# EasyEDA Pro project ProProject_PressureSensor_2023-10-08.epro, schematic Schematic1
Create Date: 2023-06-24; Page Name: P1; Project Name: PressureSensor; Schematic Name: Schematic1; Update Date: 2023-07-30; Company: 嘉立创EDA; Page Size: A4; Version: V1.0
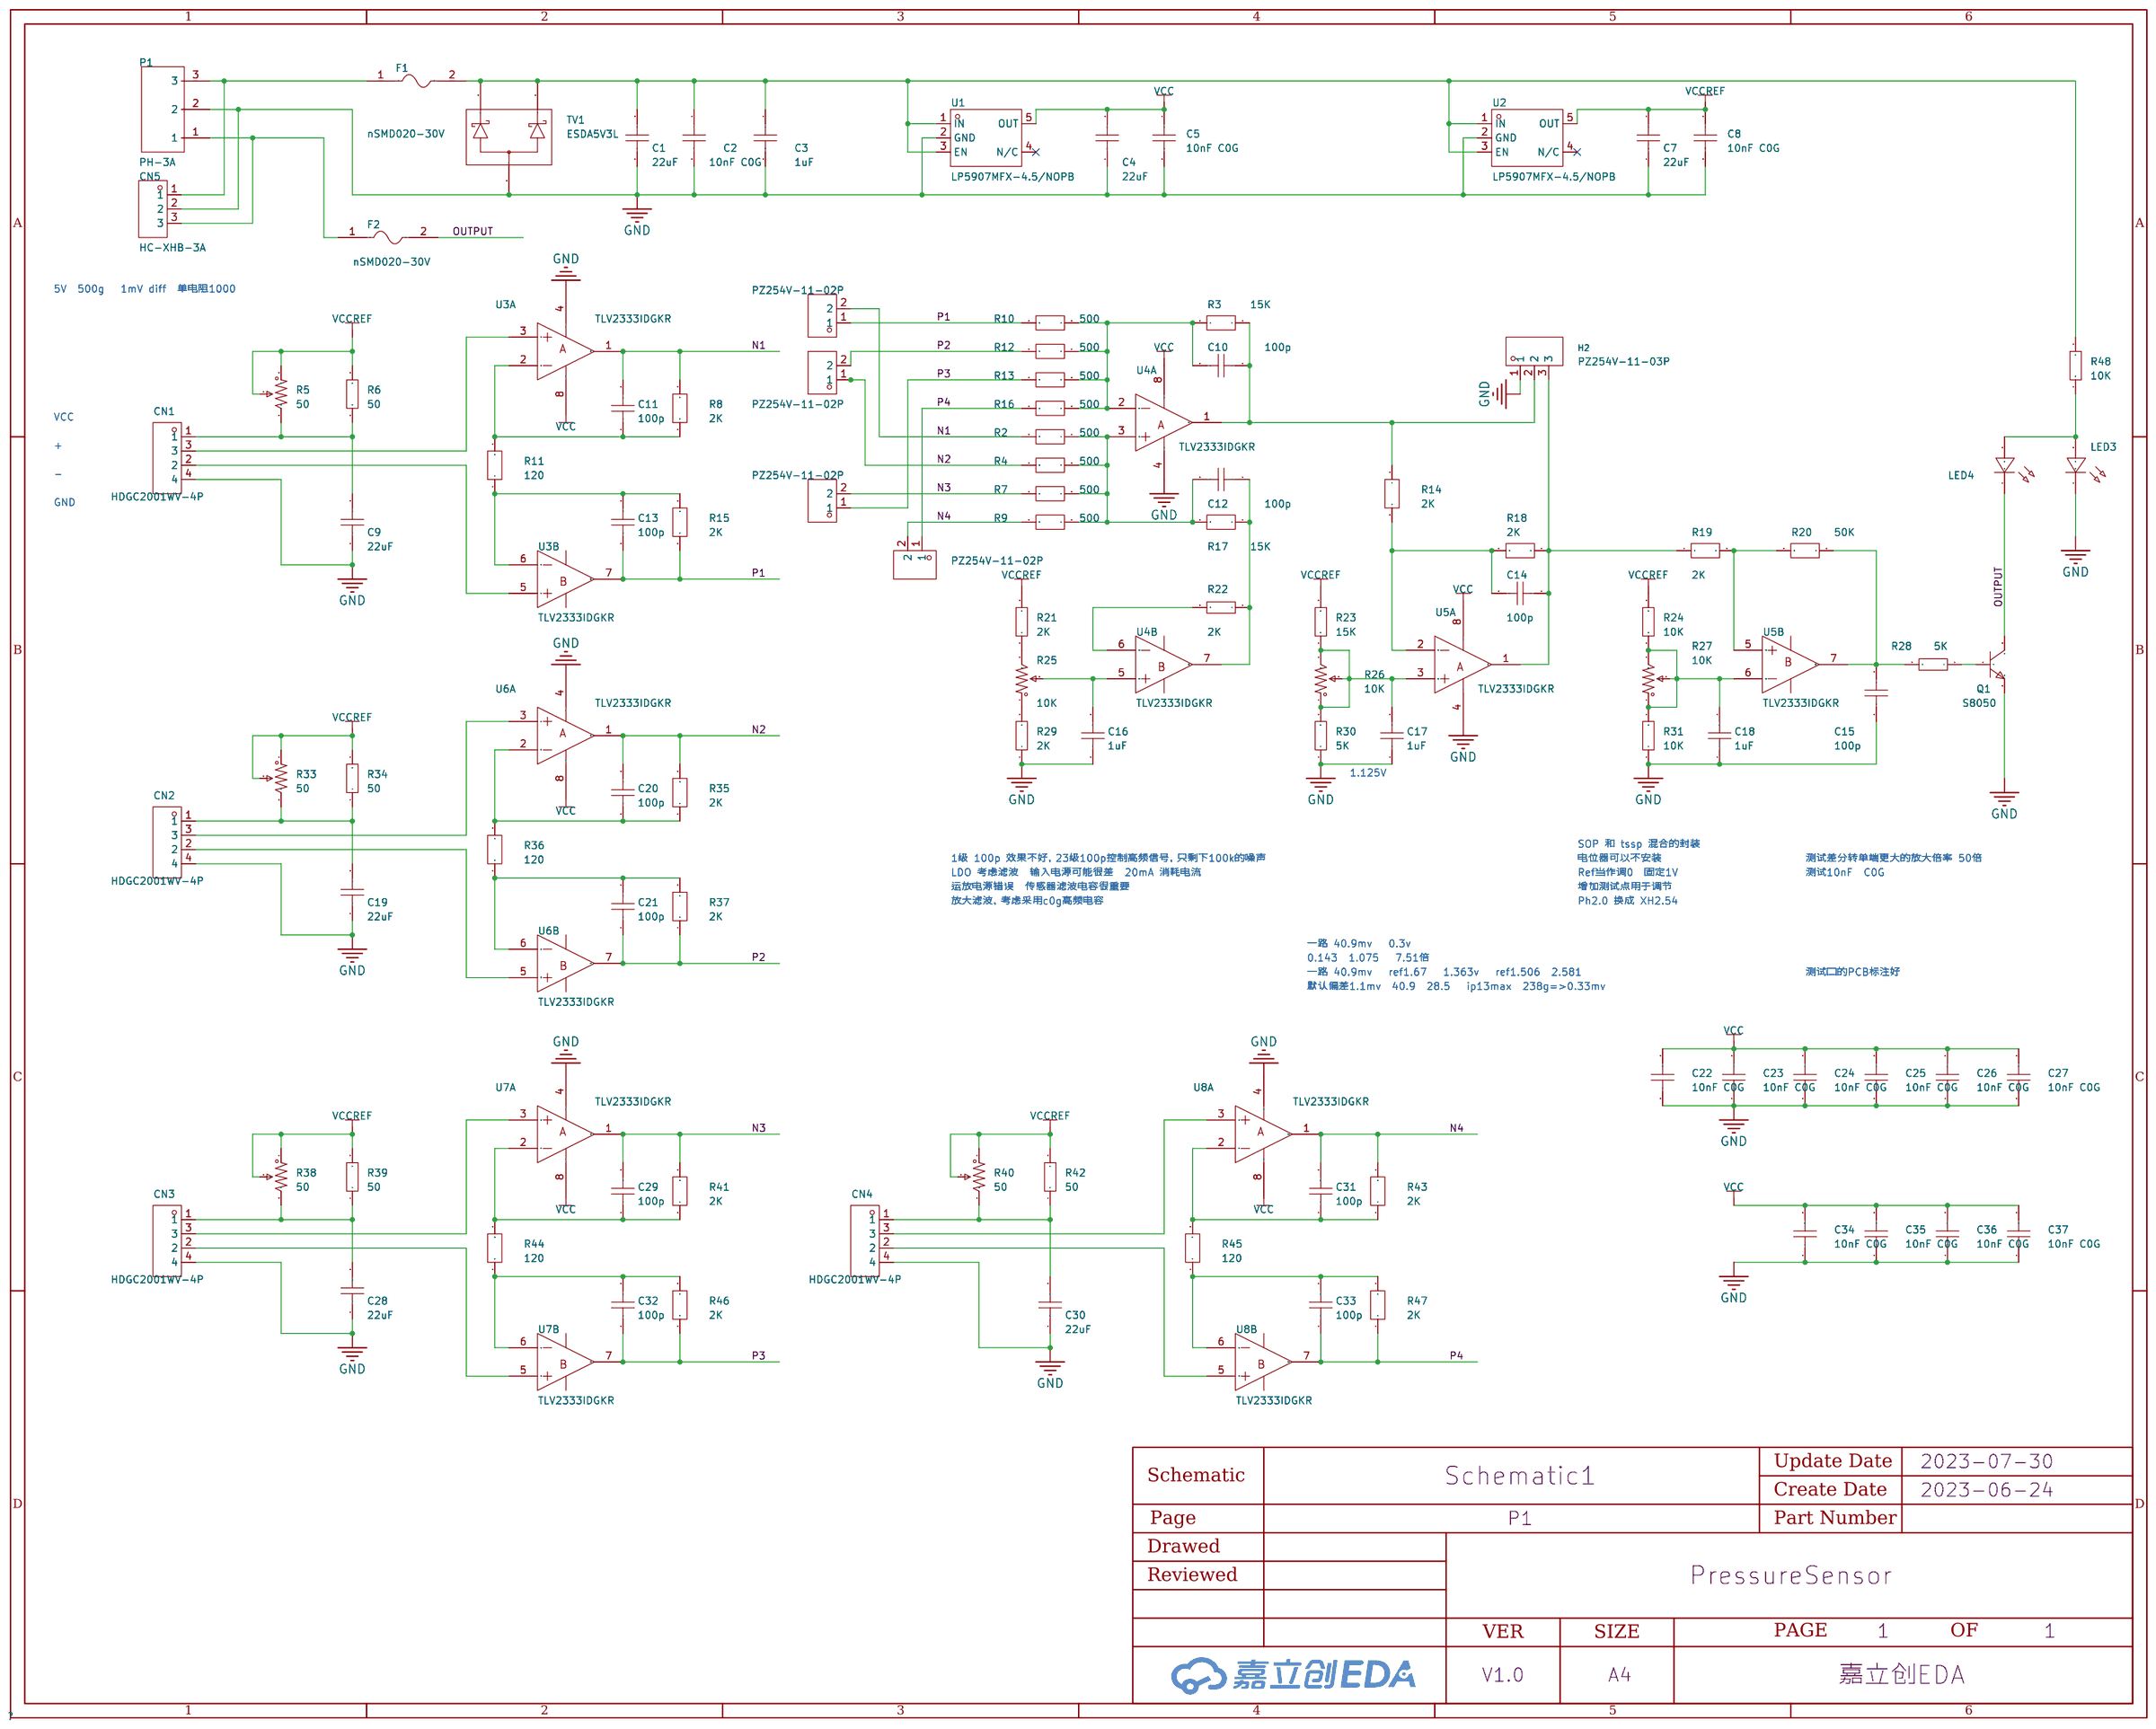
[diagram p0: schematic sheet]

## Parts
C1  22uF  [R0603]
C2  10nF C0G  [R0603]
C3  1uF  [R0603]
C4  22uF  [R0603]
C5  10nF C0G  [R0603]
C7  22uF  [R0603]
C8  10nF C0G  [R0603]
C9  22uF  [R0603]
C10  100p  [R0603]
C11  100p  [R0603]
C12  100p  [R0603]
C13  100p  [R0603]
C14  100p  [R0603]
C15  100p  [R0603]
C16  1uF  [R0603]
C17  1uF  [R0603]
C18  1uF  [R0603]
C19  22uF  [R0603]
C20  100p  [R0603]
C21  100p  [R0603]
C22  10nF C0G  [R0603]
C23  10nF C0G  [R0603]
C24  10nF C0G  [R0603]
C25  10nF C0G  [R0603]
C26  10nF C0G  [R0603]
C27  10nF C0G  [R0603]
C28  22uF  [R0603]
C29  100p  [R0603]
C30  22uF  [R0603]
C31  100p  [R0603]
C32  100p  [R0603]
C33  100p  [R0603]
C34  10nF C0G  [R0603]
C35  10nF C0G  [R0603]
C36  10nF C0G  [R0603]
C37  10nF C0G  [R0603]
CN1  HDGC2001WV-4P  [CONN-TH_4P-P2.00_HDGC_HDGC2001WV-4P]
CN2  HDGC2001WV-4P  [CONN-TH_4P-P2.00_HDGC_HDGC2001WV-4P]
CN3  HDGC2001WV-4P  [CONN-TH_4P-P2.00_HDGC_HDGC2001WV-4P]
CN4  HDGC2001WV-4P  [CONN-TH_4P-P2.00_HDGC_HDGC2001WV-4P]
CN5  HC-XHB-3A  [CONN-TH_3P-P2.50_HC-XHB-3A]
F1  nSMD020-30V  [F1206]
F2  nSMD020-30V  [F1206]
H2  PZ254V-11-03P  [HDR-TH_3P-P2.54-V-M]
H5  PZ254V-11-02P  [HDR-TH_2P-P2.54-V-M]
H6  PZ254V-11-02P  [HDR-TH_2P-P2.54-V-M]
H7  PZ254V-11-02P  [HDR-TH_2P-P2.54-V-M]
H8  PZ254V-11-02P  [HDR-TH_2P-P2.54-V-M]
LED3  -  [LED_0603]
LED4  -  [LED_0603]
P1  PH-3A  [CONN-TH_12P-P2.00-H-W4.8_PH-3A]
Q1  S8050  [SOT-23-3_L2.9-W1.6-P1.90-LS2.8-BR]
R2  500  [R0603]
R3  15K  [R0603]
R4  500  [R0603]
R5  50  [RES-ADJ-TH_3P-L10.0-W10.0-P2.50-L]
R6  50  [R0603]
R7  500  [R0603]
R8  2K  [R0603]
R9  500  [R0603]
R10  500  [R0603]
R11  120  [R0603]
R12  500  [R0603]
R13  500  [R0603]
R14  2K  [R0603]
R15  2K  [R0603]
R16  500  [R0603]
R17  15K  [R0603]
R18  2K  [R0603]
R19  2K  [R0603]
R20  50K  [R0603]
R21  2K  [R0603]
R22  2K  [R0603]
R23  15K  [R0603]
R24  10K  [R0603]
R25  10K  [RES-ADJ-TH_3P-L10.0-W10.0-P2.50-L]
R26  10K  [RES-ADJ-TH_3P-L10.0-W10.0-P2.50-L]
R27  10K  [RES-ADJ-TH_3P-L10.0-W10.0-P2.50-L]
R28  5K  [R0603]
R29  2K  [R0603]
R30  5K  [R0603]
R31  10K  [R0603]
R33  50  [RES-ADJ-TH_3P-L10.0-W10.0-P2.50-L]
R34  50  [R0603]
R35  2K  [R0603]
R36  120  [R0603]
R37  2K  [R0603]
R38  50  [RES-ADJ-TH_3P-L10.0-W10.0-P2.50-L]
R39  50  [R0603]
R40  50  [RES-ADJ-TH_3P-L10.0-W10.0-P2.50-L]
R41  2K  [R0603]
R42  50  [R0603]
R43  2K  [R0603]
R44  120  [R0603]
R45  120  [R0603]
R46  2K  [R0603]
R47  2K  [R0603]
R48  10K  [R0603]
TV1  ESDA5V3L  [SOT-23-3_L2.9-W1.6-P1.90-LS2.8-BR]
U1  LP5907MFX-4.5/NOPB  [TSOT-23-5_L2.9-W1.6-P0.95-LS2.8-BR]
U2  LP5907MFX-4.5/NOPB  [TSOT-23-5_L2.9-W1.6-P0.95-LS2.8-BR]
U3  TLV2333IDGKR  [VSSOP-8_L3.0-W3.0-P0.65-LS5.0-BL]  (sections 1,2)
U4  TLV2333IDGKR  [SOIC-8_L4.9-W3.9-P1.27-LS6.0-BL]  (sections 1,2)
U5  TLV2333IDGKR  [SOIC-8_L4.9-W3.9-P1.27-LS6.0-BL]  (sections 1,2)
U6  TLV2333IDGKR  [VSSOP-8_L3.0-W3.0-P0.65-LS5.0-BL]  (sections 1,2)
U7  TLV2333IDGKR  [VSSOP-8_L3.0-W3.0-P0.65-LS5.0-BL]  (sections 1,2)
U8  TLV2333IDGKR  [VSSOP-8_L3.0-W3.0-P0.65-LS5.0-BL]  (sections 1,2)

## Library data of the parts
C1-C5 C7-C37 = CAP_0603: Supplier Footprint: 0603
CN1-CN4 = HDGC2001WV-4P: LCSC Part Name: PH2.0直针 4P; Supplier Part: C5175232; Manufacturer: HDGC(华德共创); Supplier Footprint: 直插,P=2mm; JLCPCB Part Class: Extended Part; Datasheet: https://atta.szlcsc.com/upload/public/pdf/source/20220916/C6875813FFA1039A4B3E585D63AEFA0D.pdf; Supplier: LCSC
CN5 = HC-XHB-3A_C2845491: 参考系列:-;间距:2.5mm;插针结构:1x3P;排数:1;每排PIN数:3;行距:-;公母:公型插针;安装方式:直插;额定电流:3A;工作温度范围:-25℃~+85℃;; LCSC Part Name: 2.54带锁扣立式插件 3P 针座连接器线对板/线对线连接器; Supplier Part: C2845491; Manufacturer: HCTL(华灿天禄); Supplier Footprint: 插件,P=2.5mm; JLCPCB Part Class: Extended Part; Datasheet: https://atta.szlcsc.com/upload/public/pdf/source/20210728/C2845490_C6E0123D5C5ECC46C6D4C91ADB43F484.pdf; Supplier: LCSC; Pitch: 2.5mm; Pins Structure: 1x3P; Number of Rows: 1; Number of PINs Per Row: 3; Gender: 公型插针; Mounting Style: 直插; Current Rating (Max): 3A; Operating Temperature Range: -25℃~+85℃
F1 F2 = nSMD020-30V: 最大电压:30V;最大电流:100A;保持电流:200mA;跳闸电流:460mA;; LCSC Part Name: 30V 200mA 1206自恢复; Supplier Part: C69680; Manufacturer: 台湾陆海; Supplier Footprint: 1206; JLCPCB Part Class: Extended Part; Datasheet: https://atta.szlcsc.com/upload/public/pdf/source/20230404/9F5B471D89C649BCC2835D46521A6324.pdf; Supplier: LCSC; Operating Voltage (Max): 30V; Current Rating (Max): 100A; Hold Current: 200mA; Trip Current: 460mA
H2 = PZ254V-11-03P: 排数:单排;总PIN位数:3;间距:2.54mm;插针结构:1x3P;行距:-;安装类型:直插;圆针/方针:方针;额定电流:3A;额定电压:250V;配合针长度:6mm;塑高:2.5mm;端接针长度:3mm;工作温度范围:-40℃~+105℃;颜色:黑色;; LCSC Part Name: 2.54mm 1x3P 直插 方针; Supplier Part: C2937625; Manufacturer: XFCN(兴飞); Supplier Footprint: 直插,P=2.54mm; JLCPCB Part Class: Extended Part; Datasheet: 2022-07-12/581362A/62b9d00620994b3696be7eb4af85ad72/双排排针和单排排针.pdf; Supplier: LCSC; Number of Rows: 单排; Number of Pins: 3; Pitch: 2.54mm; Pin Structure: 1x3P; Mounting Type: 直插; Circluar Pins/Square Pins: 方针; Current Rating (Max): 3A; Voltage Rating (Max): 250V; Length of Mating Pin: 6mm; Insulation Height: 2.5mm; Length of End Connection Pin: 3mm; Operating Temperature Range: -40℃~+105℃; Color: 黑色
H5-H8 = PZ254V-11-02P: 排数:单排;总PIN位数:2P;间距:2.54mm;插针结构:1x2P;行距:-;安装类型:直插;圆针/方针:方针;额定电流:-;额定电压:-;配合针长度:6mm;塑高:2.5mm;端接针长度:3mm;触头材质:黄铜;触头镀层:-;工作温度范围:-40℃~+105℃;颜色:黑色;; LCSC Part Name: 2.54mm 1x2P 直插 方针; Supplier Part: C492401; Manufacturer: XFCN(兴飞); Supplier Footprint: 插件,P=2.54mm; JLCPCB Part Class: Extended Part; Datasheet: https://atta.szlcsc.com/upload/public/pdf/source/20200309/C492401_A812433581A9B211A7FFA413ADDFF0E5.pdf; Supplier: LCSC; Number of Rows: 单排; Number of Pins: 2P; Pitch: 2.54mm; Pin Structure: 1x2P; Mounting Type: 直插; Circluar Pins/Square Pins: 方针; Length of Mating Pin: 6mm; Insulation Height: 2.5mm; Length of End Connection Pin: 3mm; Contact Material: 黄铜; Operating Temperature Range: -40℃~+105℃; Color: 黑色
LED3 LED4 = LED_0603-B: Supplier Footprint: 0603
P1 = PH-3A_C2320: 参考系列:PH;间距:2mm;插针结构:1x3P;排数:1;每排PIN数:3;行距:-;安装方式:-;触头材质:-;; LCSC Part Name: PH 2mm 1x3P 直插; Supplier Part: C2320; Manufacturer: BOOMELE(博穆精密); Supplier Footprint: 插件,P=2mm; JLCPCB Part Class: Extended Part; Datasheet: https://atta.szlcsc.com/upload/public/pdf/source/20151118/1457707579328.pdf; Supplier: LCSC; Reference Series: PH; Pitch: 2mm; Pins Structure: 1x3P; Number of Rows: 1; Number of PINs Per Row: 3
Q1 = S8050_C105433: 晶体管类型:NPN;集射极击穿电压(Vceo):25V;集电极电流(Ic):500mA;功率(Pd):300mW;直流电流增益(hFE@Ic,Vce):120@50mA,1V;; LCSC Part Name: NPN 25V 500mA L档 120-200; Supplier Part: C105433; Manufacturer: CJ(江苏长电/长晶); Supplier Footprint: SOT-23; JLCPCB Part Class: Extended Part; Datasheet: https://atta.szlcsc.com/upload/public/pdf/source/20170415/1492237762328.pdf; Supplier: LCSC; Transistor Type: NPN; Collector-Emitter Breakdown Voltage (Vceo): 25V; Collector Current (Ic): 500mA; Power Dissipation (Pd): 300mW; Collector Cut-Off Current (Icbo): 100nA; Collector-Emitter Saturation Voltage (VCE(sat)@Ic,Ib): 600mV@500mA,50mA; DC Current Gain (hFE@Ic,Vce): 120@50mA,1V; Transition Frequency (fT): 150MHz; Operating Temperature: +150℃@(Tj)
R2-R4 R7-R20 R35-R37 R41 R43-R47 = ARG02BTC4R70: 阻值:4.7Ω;精度:±0.1%;温度系数:±25ppm/℃;; LCSC Part Name: 4.7Ω ±0.1%; Supplier Part: C2984422; Manufacturer: Viking(光颉); Supplier Footprint: 0402; JLCPCB Part Class: Extended Part; Datasheet: https://atta.szlcsc.com/upload/public/pdf/source/20200117/C485675_99063924B4564AF910B7BE66DA8EFA49.pdf; Supplier: LCSC; Tolerance: ±0.1%; Temperature Coefficient: ±25ppm/℃
R5 R25-R27 R33 R38 R40 = 3296W-1-103: 阻值:10kΩ;精度:±10%;; LCSC Part Name: 10kΩ ±10%; Supplier Part: C118954; Manufacturer: BOCHEN(博晨); Supplier Footprint: 插件; JLCPCB Part Class: Extended Part; Datasheet: https://atta.szlcsc.com/upload/public/pdf/source/20171114/C118954_15106326646611117443.pdf; Supplier: LCSC; Tolerance: ±10%
R6 R21-R24 R28-R31 R34 R39 R42 R48 = Res_0603: Supplier Footprint: 0603
TV1 = ESDA5V3L_C87911: Supplier Part: C87911; Manufacturer: ST(意法半导体); Supplier Footprint: SOT-23; JLCPCB Part Class: Extended Part; Datasheet: https://atta.szlcsc.com/upload/public/pdf/source/20161123/1479873117957.pdf; Supplier: LCSC
U1 U2 = LP5907MFX-4.5/NOPB: 输出类型:-;; Supplier Part: C529554; Manufacturer: TI(德州仪器); Supplier Footprint: SOT-23-5; JLCPCB Part Class: Extended Part; Datasheet: https://atta.szlcsc.com/upload/public/pdf/source/20200515/C529554_1F6A3CAA36CA0E645A19879A5E39A7AD.pdf; Supplier: LCSC
U3-U8 = TLV2333IDGKR: 放大器组数:-;; Supplier Part: C527573; Manufacturer: TI(德州仪器); Supplier Footprint: VSSOP-8; JLCPCB Part Class: Extended Part; Datasheet: https://atta.szlcsc.com/upload/public/pdf/source/20200508/C527573_3F1EAB2C8CE40A63573F2737A046710C.pdf; Supplier: LCSC

## Nets
GND: C1.1 C2.2 C3.2 C4.1 C5.2 C7.1 C8.2 C9.1 C15.2 C16.1 C17.1 C18.1 C19.1 C22.1 C23.1 C24.1 C25.1 C26.1 C27.1 C28.1 C30.1 C34.1 C35.1 C36.1 C37.1 CN1.4 CN2.4 CN3.4 CN4.4 CN5.2 H2.1 LED3.1(C) P1.2 Q1.2 R29.1 R30.1 R31.1 TV1.3 U1.2(GND) U2.2(GND) U3.4(V-) U4.4(V-) U5.4(V-) U6.4(V-) U7.4(V-) U8.4(V-)
VCC: C4.2 C5.1 C22.2 C23.2 C24.2 C25.2 C26.2 C27.2 C34.2 C35.2 C36.2 C37.2 U1.5(OUT) U3.8(V+) U4.8(V+) U5.8(V+) U6.8(V+) U7.8(V+) U8.8(V+)
VCCREF: C7.2 C8.1 R5.1 R5.2 R6.2 R21.2 R23.2 R24.2 R33.1 R33.2 R34.2 R38.1 R38.2 R39.2 R40.1 R40.2 R42.2 U2.5(OUT)
N1: C11.2 H5.2 R2.2 R8.2 U3.1(OUTA)
N2: C20.2 H8.1 R4.2 R35.2 U6.1(OUTA)
N3: C29.2 H6.2 R7.2 R41.2 U7.1(OUTA)
N4: C31.2 H7.2 R9.2 R43.2 U8.1(OUTA)
OUTPUT: F2.2 LED4.1(C) Q1.3
P1: C13.1 H5.1 R10.2 R15.1 U3.7(OUTB)
P2: C21.1 H8.2 R12.2 R37.1 U6.7(OUTB)
P3: C32.1 H6.1 R13.2 R46.1 U7.7(OUTB)
P4: C33.1 H7.1 R16.2 R47.1 U8.7(OUTB)
$1N30553: CN1.3 U3.3(INA+)
$1N30561: CN1.2 U3.5(INB+)
$1N30605: C11.1 R8.1 R11.2 U3.2(INA-)
$1N30608: C13.2 R11.1 R15.2 U3.6(INB-)
$1N32010: R21.1 R25.3
$1N32012: R25.1 R29.2
$1N32045: C16.2 R25.2 U4.5(INB+)
$1N32103: R22.2 U4.6(INB-)
$1N32162: C10.2 R3.2 R10.1 R12.1 R13.1 R16.1 U4.2(INA-)
$1N32193: C12.1 R17.1 R22.1 U4.7(OUTB)
$1N32196: C12.2 R2.1 R4.1 R7.1 R9.1 R17.2 U4.3(INA+)
$1N33007: R19.2 R20.2 U5.5(INB+)
$1N33240: Q1.1 R28.1
$1N33276: C15.1 R20.1 R28.2 U5.7(OUTB)
$1N35532: C10.1 H2.2 R3.1 R14.1 U4.1(OUTA)
$1N36334: C14.1 H2.3 R18.1 R19.1 U5.1(OUTA)
$1N36352: C14.2 R14.2 R18.2 U5.2(INA-)
$1N36780: CN2.3 U6.3(INA+)
$1N36784: CN2.2 U6.5(INB+)
$1N36792: C20.1 R35.1 R36.2 U6.2(INA-)
$1N36797: C21.2 R36.1 R37.2 U6.6(INB-)
$1N37205: CN3.3 U7.3(INA+)
$1N37209: CN3.2 U7.5(INB+)
$1N37217: C29.1 R41.1 R44.2 U7.2(INA-)
$1N37222: C32.2 R44.1 R46.2 U7.6(INB-)
$1N37630: CN4.3 U8.3(INA+)
$1N37634: CN4.2 U8.5(INB+)
$1N37642: C31.1 R43.1 R45.2 U8.2(INA-)
$1N37647: C33.2 R45.1 R47.2 U8.6(INB-)
$1N37723: C19.2 CN2.1 R33.3 R34.1
$1N37747: C28.2 CN3.1 R38.3 R39.1
$1N37752: C9.2 CN1.1 R5.3 R6.1
$1N37762: C30.2 CN4.1 R40.3 R42.1
$1N42503: CN5.1 F1.1 P1.3
$1N42542: CN5.3 F2.1 P1.1
$1N42787: LED3.2(A) LED4.2(A) R48.1
$1N42798: C1.2 C2.1 C3.1 F1.2 R48.2 TV1.1 TV1.2 U1.1(IN) U1.3(EN) U2.1(IN) U2.3(EN)
$1N53934: C17.2 R23.1 R26.1 R26.2 R26.3 R30.2 U5.3(INA+)
Net-(C18-2): C18.2 R24.1 R27.1 R27.2 R27.3 R31.2 U5.6(INB-)

Not connected (* = marked no-connect by the designer): U1 4(N/C)*; U2 4(N/C)*

## Notes on the sheet
- 5V  500g   1mV diff  单电阻1000
- VCC
- +
- -
- GND
- 1.125V
- SOP 和 tssp 混合的封装
- 1级 100p 效果不好，23级100p控制高频信号，只剩下100k的噪声
- 电位器可以不安装
- 测试差分转单端更大的放大倍率 50倍
- LDO 考虑滤波  输入电源可能很差  20mA 消耗电流
- 运放电源错误  传感器滤波电容很重要
- Ref当作调0  固定1V
- 增加测试点用于调节
- 测试10nF  C0G
- 放大滤波，考虑采用c0g高频电容
- Ph2.0 换成 XH2.54
- 一路 40.9mv   0.3v
- 0.143  1.075   7.51倍
- 一路 40.9mv   ref1.67   1.363v   ref1.506  2.581
- 默认偏差1.1mv  40.9  28.5   ip13max  238g=>0.33mv
- 测试口的PCB标注好
